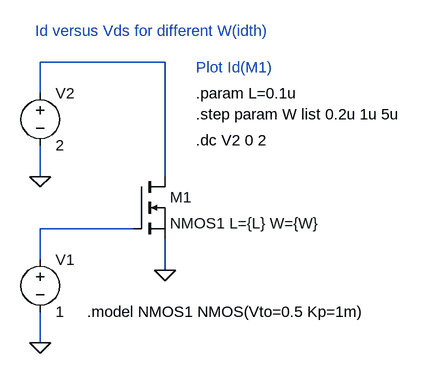
[diagram p0: schematic nmos_step_w.asc]
nmos_step_w.asc, the LTspice schematic file:
Version 4
SHEET 1 880 680
WIRE 288 -128 96 -128
WIRE 96 -80 96 -128
WIRE 96 48 96 0
WIRE 288 48 288 -128
WIRE 240 128 96 128
WIRE 96 176 96 128
WIRE 288 192 288 144
WIRE 96 304 96 256
FLAG 288 192 0
FLAG 96 48 0
FLAG 96 304 0
SYMBOL nmos 240 48 R0
SYMATTR InstName M1
SYMATTR Value NMOS1 L={L} W={W}
SYMBOL voltage 96 160 R0
SYMATTR InstName V1
SYMATTR Value 1
SYMBOL voltage 96 -96 R0
WINDOW 123 0 0 Left 0
WINDOW 39 0 0 Left 0
SYMATTR InstName V2
SYMATTR Value 2
TEXT 168 256 Left 0 !.model NMOS1 NMOS(Vto=0.5 Kp=1m)
TEXT 336 -48 Left 0 !.step param W list 0.2u 1u 5u
TEXT 336 -80 Left 0 !.param L=0.1u
TEXT 336 -8 Left 0 !.dc V2 0 2 
TEXT 336 -120 Left 0 ;Plot Id(M1)
TEXT 88 -176 Left 0 ;Id versus Vds for different W(idth)

The netlist it stands for:
* nmos_step_w.asc
M1 N001 N002 0 0 NMOS1 L={L} W={W}
V1 N002 0 1
V2 N001 0 2
.model NMOS NMOS
.model PMOS PMOS
.lib standard.mos
.model NMOS1 NMOS(Vto=0.5 Kp=1m)
.step param W list 0.2u 1u 5u
.param L=0.1u
.dc V2 0 2
* Plot Id(M1)
* Id versus Vds for different W(idth)
.backanno
.end